# EAGLE design MAX9709_Mono_Bridge_AMP_1V2 (EAGLE 6.4)
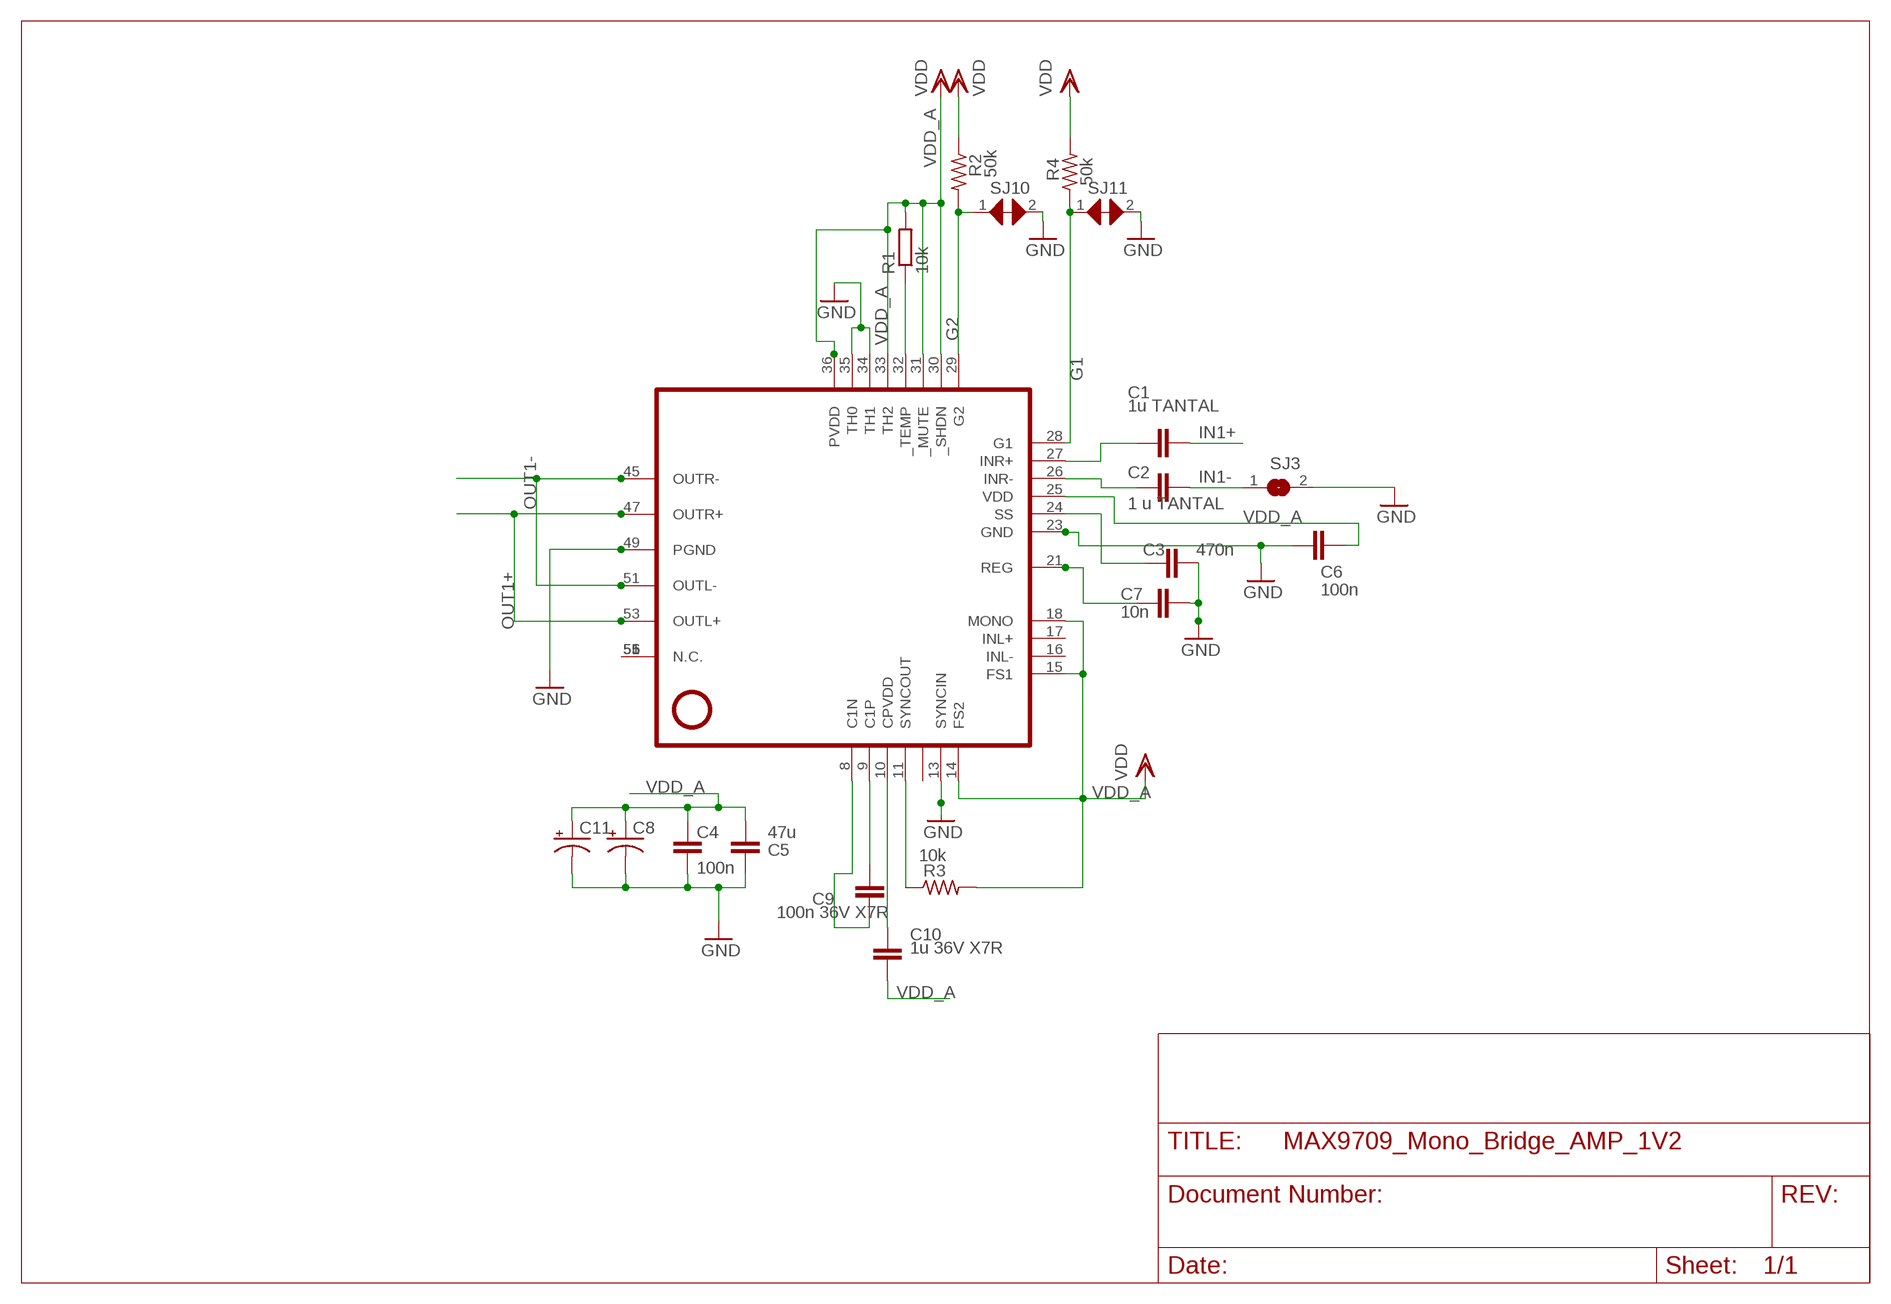
[diagram p0: schematic, sheet 1]

## Parts
C1  1u TANTAL  CAP-SMD0805  [0805]
C2  1 u TANTAL  CAP-SMD0805  [0805]
C3  470n  C-EUC0402K  [C0402K]
C4  100n  CAP-SMD0603  [0603]
C5  47u  CAP-SMD0603  [0603]
C6  100n  C-EUC0402K  [C0402K]
C7  10n  C-EUC0402K  [C0402K]
C8  CPOL-USCT7343  [CT7343]
C9  100n 36V X7R  CAP-SMD0805  [0805]
C10  1u 36V X7R  CAP-SMD0805  [0805]
C11  CPOL-USCT7343  [CT7343]
IC1  MAX9709  [56-QFN]
R1  10k  R-EU_R0402  [R0402]
R2  50k  R-US_R0402  [R0402]
R3  10k  R-US_R0402  [R0402]
R4  50k  R-US_R0402  [R0402]
SJ3  JUMPER_SMD  [JUMPER_SMD_SJ]
SJ10  JUMPER_SMD_MICRO_SHORT  [JUMPER_SMD_MICRO_SHORT]
SJ11  JUMPER_SMD_MICRO_SHORT  [JUMPER_SMD_MICRO_SHORT]

## Nets
G1: IC1.28(G1) R4.1 SJ11.1
G2: IC1.29(G2) R2.2 SJ10.1
GND: C3.2 C4.2 C5.2 C6.1 C7.2 C8.- C11.- IC1.2(PGND$2) IC1.3(PGND$3) IC1.4(PGND$4) IC1.13(SYNCIN) IC1.22(GND2) IC1.23(GND) IC1.34(TH1) IC1.35(TH0) IC1.39(PGND$39) IC1.40(PGND$40) IC1.41(PGND$41) IC1.49(PGND) IC1.50(PGND$8) IC1.P$1(GND1) IC1.P$2(GND3) IC1.P$3(GND4) IC1.P$4(GND5) IC1.P$5(GND6) IC1.P$6(GND7) IC1.P$7(GND8) IC1.P$8(GND9) IC1.P$9(GND10) IC1.P$10(GND11) IC1.P$11(GND12) IC1.P$12(GND13) IC1.P$13(GND14) IC1.P$14(GND15) IC1.P$15(GND16) IC1.P$16(GND17) IC1.P$17(GND18) IC1.P$18(GND19) IC1.P$19(GND20) IC1.P$20(GND21) IC1.P$21(GND22) IC1.P$22(GND23) IC1.P$23(GND24) IC1.P$24(GND25) IC1.P$25(GND26) SJ3.2 SJ10.2 SJ11.2
IN1+: C1.P$1
IN1-: C2.P$1 SJ3.1
N$1: C9.P$1 IC1.8(C1N)
N$2: C9.P$2 IC1.9(C1P)
N$4: C1.P$2 IC1.27(INR+)
N$5: C2.P$2 IC1.26(INR-)
N$8: IC1.32(_TEMP) R1.1
N$12: C10.P$2 IC1.10(CPVDD)
N$15: IC1.11(SYNCOUT) R3.1
OUT1+: IC1.47(OUTR+) IC1.48(OUTR+2) IC1.53(OUTL+) IC1.54(OUTL+2)
OUT1-: IC1.45(OUTR-) IC1.46(OUTR-2) IC1.51(OUTL-) IC1.52(OUTL-2)
REG: C7.1 IC1.19(REG3) IC1.20(REG2) IC1.21(REG)
SS: C3.1 IC1.24(SS)
VDD_A: C4.1 C5.1 C6.2 C8.+ C10.P$1 C11.+ IC1.5(PVDD$5) IC1.6(PVDD$6) IC1.7(PVDD$7) IC1.14(FS2) IC1.15(FS1) IC1.18(MONO) IC1.25(VDD) IC1.30(_SHDN) IC1.31(_MUTE) IC1.33(TH2) IC1.36(PVDD) IC1.37(PVDD$37) IC1.38(PVDD$38) R1.2 R2.1 R3.2 R4.2 ; supply symbol labelled VDD
Unconnected: IC1.1(N.C.) IC1.12(N.C.$12) IC1.16(INL-) IC1.17(INL+) IC1.42(N.C.$42) IC1.43(N.C.$43) IC1.44(N.C.$44) IC1.55(N.C.$55) IC1.56(N.C.$56)

## Library data of the parts
C1 C2 C4 C5 C9 C10 = lve:CAP-SMD
C3 C6 C7 = rcl:C-EU: CAPACITOR, European symbol
C8 C11 = rcl:CPOL-US: POLARIZED CAPACITOR, American symbol
IC1 = maxim_9709:MAX9709: Class D PA
R1 = rcl:R-EU_: RESISTOR, European symbol
R2-R4 = rcl:R-US_: RESISTOR, American symbol
SJ3 = lve:JUMPER_SMD
SJ10 SJ11 = dzo:JUMPER_SMD_MICRO_SHORT

## Board
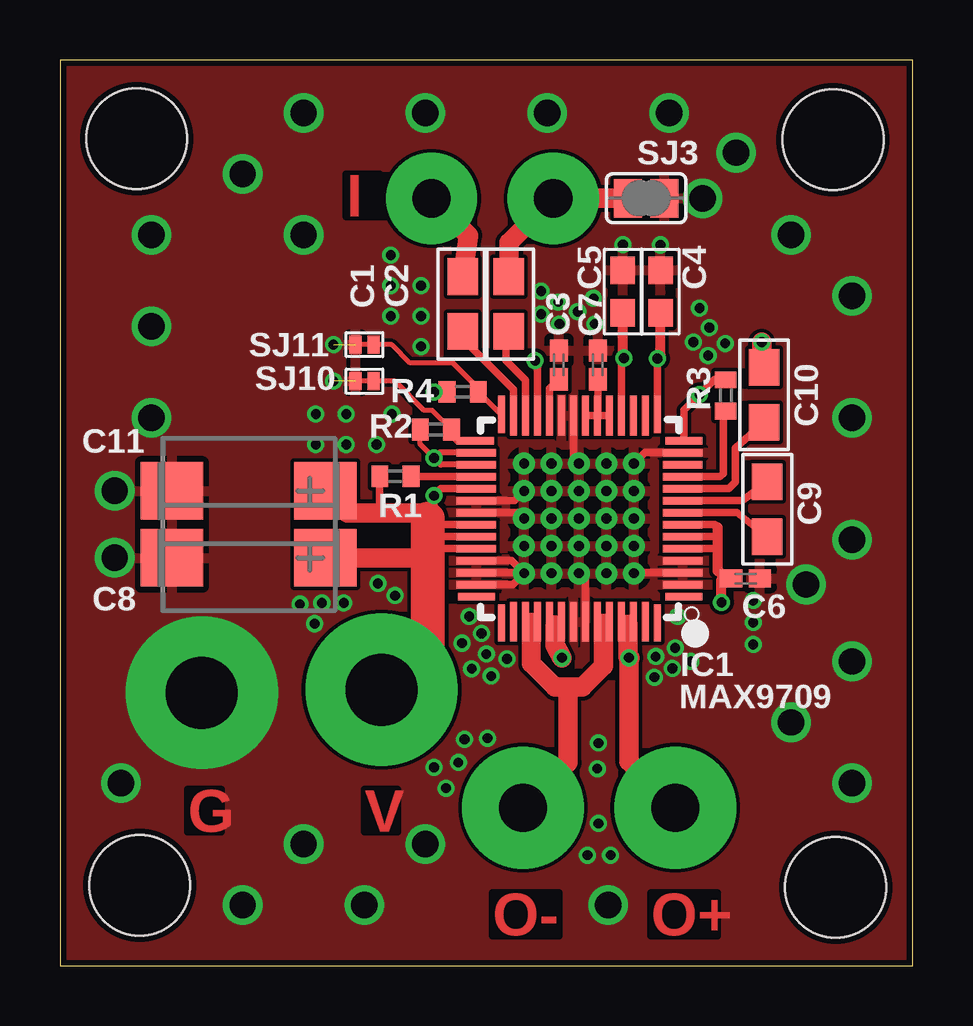
[diagram p1: board, top side]
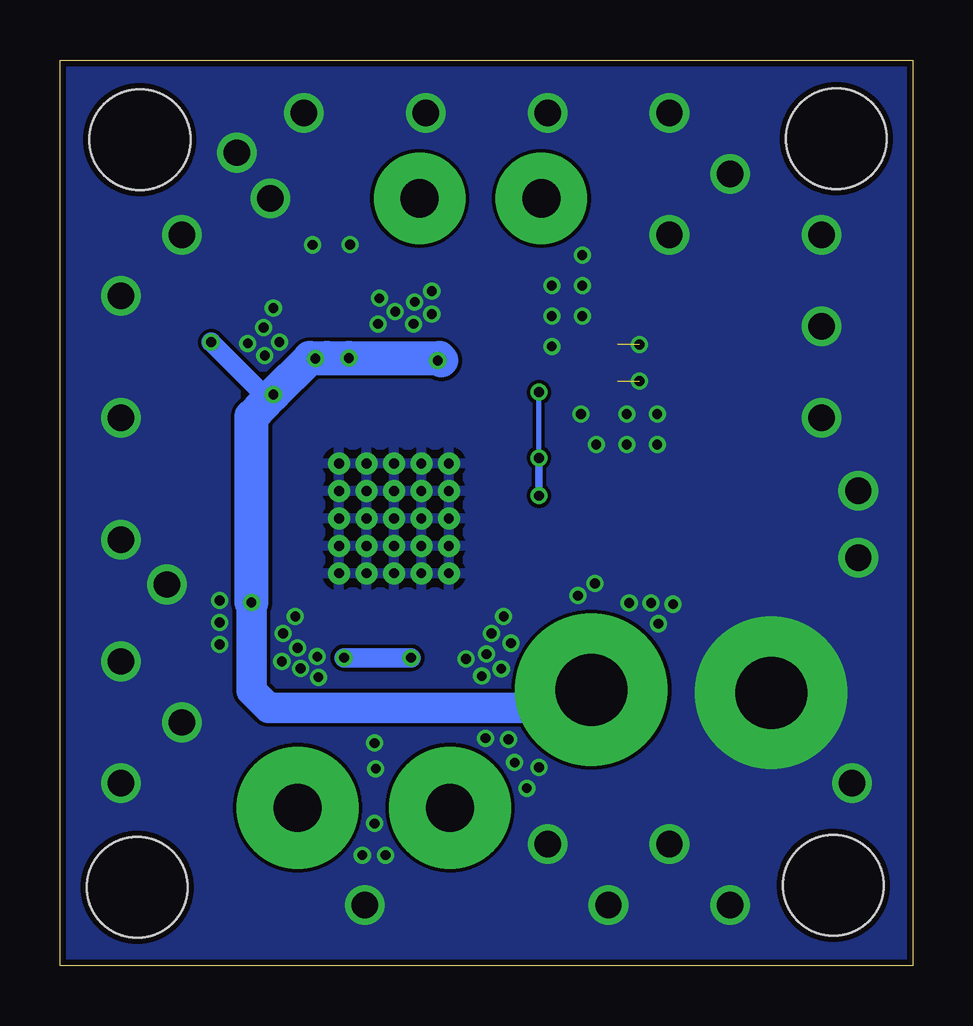
[diagram p2: board, bottom side, seen from below]

Size 35.56 x 37.77 mm. Coordinates in mm from the lower left corner, seen from the top.
Outline: 0,0 35.56,0 35.56,37.77 0,37.77 0,0
Copper layers (1*16): Top 0.035mm / dielectric 1.5mm / Bottom 0.035mm
Design rules "ITEADstudio_DRC": minimum track width 6mil, minimum drill 12mil, track to track 6mil, track to pad 6mil, pad to pad 6mil, via to via 6mil, smd to smd 0mil, copper to edge 10mil, drill to drill 10mil, minimum pad ring 10mil, minimum via ring 6mil, stop-mask expansion 2mil, vias tented up to drill 100mil, thermal gap 10mil
Holes 4.2 mm at 3.19,34.49 3.32,3.36 32.23,34.44 32.34,3.28

### Footprints (pad centres in the part's own frame; a part is rotated, then mirrored left to right if it is on the bottom)
0805 = smd 1.524 x 1.27: P$1 -1.143,0; P$2 1.143,0
C0402K = smd 0.925 x 0.74: 1 -0.6,0; 2 0.6,0
0603 = smd 1.143 x 1.016: 1 -0.889,0; 2 0.889,0
CT7343 = smd 2.6 x 2.4: + -3.2,0; - 3.2,0
56-QFN = smd 0.3 x 1.548: 1 -2.75,-3.081; 14 3.75,-3.081; 29 3.75,5.621; 42 -2.75,5.57 | smd 0.3 x 1.65: 2 -2.25,-3.03; 3 -1.75,-3.03; 4 -1.25,-3.03; 5 -0.75,-3.03; 6 -0.25,-3.03; 7 0.25,-3.03; 8 0.75,-3.03; 9 1.25,-3.03; 10 1.75,-3.03; 11 2.25,-3.03; 12 2.75,-3.03; 13 3.25,-3.03; 30 3.25,5.57; 31 2.75,5.57; 32 2.25,5.57; 33 1.75,5.57; 34 1.25,5.57; 35 0.75,5.57; 36 0.25,5.57; 37 -0.25,5.57; 38 -0.75,5.57; 39 -1.25,5.57; 40 -1.75,5.57; 41 -2.25,5.57 | smd 1.548 x 0.3: 15 4.851,-1.98; 28 4.851,4.52; 43 -3.851,4.52; 56 -3.851,-1.98 | smd 1.65 x 0.3: 16 4.8,-1.48; 17 4.8,-0.98; 18 4.8,-0.48; 19 4.8,0.02; 20 4.8,0.52; 21 4.8,1.02; 22 4.8,1.52; 23 4.8,2.02; 24 4.8,2.52; 25 4.8,3.02; 26 4.8,3.52; 27 4.8,4.02; 44 -3.8,4.02; 45 -3.8,3.52; 46 -3.8,3.02; 47 -3.8,2.52; 48 -3.8,2.02; 49 -3.8,1.52; 50 -3.8,1.02; 51 -3.8,0.52; 52 -3.8,0.02; 53 -3.8,-0.48; 54 -3.8,-0.98; 55 -3.8,-1.48 | drill 0.406: P$1 -1.778,3.581; P$2 0.508,3.581; P$3 -0.635,3.581; P$4 -0.635,2.438; P$5 1.651,3.581; P$6 2.794,3.581; P$7 2.794,2.438; P$8 1.651,2.438; P$9 0.508,2.438; P$10 -1.778,2.438; P$11 -1.778,1.295; P$12 -0.635,1.295; P$13 0.508,1.295; P$14 1.651,1.295; P$15 2.794,1.295; P$16 2.794,0.152; P$17 1.651,0.152; P$18 0.508,0.152; P$19 -0.635,0.152; P$20 -1.778,0.152; P$21 -1.778,-0.991; P$22 -0.635,-0.991; P$23 0.508,-0.991; P$24 1.651,-0.991; P$25 2.794,-0.991
R0402 = smd 0.7 x 0.9: 1 -0.65,0; 2 0.65,0
JUMPER_SMD_SJ = smd 1.168 x 1.6: 1 -0.762,0; 2 0.762,0
JUMPER_SMD_MICRO_SHORT = smd 0.508 x 0.762: 1 -0.381,0; 2 0.381,0

### Placement (x,y rotation side)
C1  16.78,27.6 270 top
C2  18.71,27.6 270 top
C3  20.8,25.06 90 top
C4  25.04,28.11 90 top
C5  23.46,28.11 90 top
C6  28.58,16.15 180 top
C7  22.42,25.06 90 top
C8  7.87,17.01 180 top
C9  29.48,19.04 90 top
C10  29.36,23.81 270 top
C11  7.87,19.81 180 top
IC1  22.93,18.15 90 top
R1  13.98,20.42 180 top
R2  15.67,22.36 0 top
R3  27.76,23.79 90 top
R4  16.78,23.94 180 top
SJ3  24.44,32.01 0 top
SJ10  12.69,24.38 180 top
SJ11  12.69,25.9 180 top

### Tracks (layer width: path | path; a pad name or v marks a point on that pad's centre or on a via)
G1
  Top 0.203: IC1.28 18.37,23 R4.1 17.43,24.09 16.38,25.14 14.6,25.14 13.84,25.9 SJ11.1
G2
  Top 0.203: R2.2 15.52,23.16 15.18,23.16 13.96,24.38 SJ10.1
  Top 0.305: IC1.29 16.58,21.9 16.16,22.31 R2.2
GND  (via drill 0.41, 1.1, 3 pad 6.35)  (2 unrouted)
  Top 0.305: IC1.22 21.41,21.17 IC1.P$15 | IC1.13 24.38,21.4 IC1.P$25 | IC1.3 23.95,16.4 IC1.P$21 | IC1.50 21.91,16.1 IC1.P$11 | IC1.41 18.88,15.9 IC1.P$1 | IC1.40 19.32,16.4 IC1.P$1 | IC1.39 18.82,16.9 IC1.P$1 | IC1.34 18.95,19.4 IC1.P$5 | IC1.35 19.11,18.9 IC1.P$2
  other vias: 5.91,11.39 10.15,5.08 15.23,5.08 33.01,7.62 33.01,12.7 30.47,10.16 31.11,15.9 33.01,17.78 33.01,22.86 33.01,27.94 25.39,35.56 10.15,35.56 7.61,33.02 28.19,33.91 30.47,30.48 2.28,17.01 2.28,19.81 25.03,30.06 23.46,30.07 26.79,32 25.75,14.58 26.26,13.86 25.65,13.26 18.64,12.8 17.77,13 17.57,13.86 17.06,14.58 17.98,12.09 16.76,13.46 17.16,12.39 13.96,15.44 13.25,15.95 10.66,21.74 15.06,25.83 20.82,26.77 22.3,26.77 21.58,27.28 20.06,27.17 22.24,27.83 20.77,27.68 20.06,28.14 27.02,25.45 26.41,26.01 27.73,25.96 27.07,26.62 26.66,27.43 28.9,15.24 28.9,14.32 28.9,13.41 22.45,9.29 22.4,8.23 22.45,5.94 21.99,4.62 22.96,4.62 17.83,9.5 16.86,9.45 16.61,8.48 15.59,8.28 16.1,7.41 11.83,15.13 10.92,15.13 10.61,14.27 10,15.08 15.23,35.56 20.31,35.56 24.84,12.9 24.78,12.04 26.31,12.7 25.53,12.41 11.4,25.9 11.4,24.38 15.06,27.1 15.06,28.37 13.79,27.1 13.79,28.37 13.79,29.64 11.93,21.74 13.2,21.74 13.84,23.01 11.93,23.01 10.66,23.01 10.15,30.48 3.8,30.48 3.8,26.67 3.8,22.86 2.53,7.62 7.61,2.54 12.69,2.54 22.85,2.54
  pour Top: 0.02,0.06 0.02,37.76 35.65,37.76 35.65,0.06
  pour Bottom: 0.02,37.76 0.02,0.06 35.68,0.06 35.68,37.76
IN1+  (via drill 1.6 pad 3.81)
  Top 0.813: C1.P$1 17.04,30.45 v15.49,32
IN1-  (via drill 1.6 pad 3.81)
  Top 0.813: C2.P$1 18.71,30.15 v20.57,32 SJ3.1
N$1
  Top 0.305: IC1.8 28.23,18.9 C9.P$1
N$2
  Top 0.305: IC1.9 28.45,19.4 C9.P$2
N$4
  Top 0.305: IC1.27 18.91,24.02 17.04,25.9 C1.P$2
N$5
  Top 0.305: C2.P$2 18.7,26.27 | IC1.26 19.41,24.42 18.59,25.24 18.59,26.33 C2.P$2 | C2.P$2 18.59,26.02
N$8
  Top 0.305: IC1.32 14.71,20.4 R1.1
N$12
  Top 0.305: IC1.10 27.88,19.9 28.16,20.18 28.16,21.6 C10.P$2
N$15
  Top 0.305: IC1.11 27.52,20.4 27.66,20.54 27.66,23.04 R3.1
OUT1+  (via drill 0.41, 2 pad 5.08)
  Top 0.305: IC1.53 IC1.54 23.8,14.24 23.67,14.24 | IC1.48 20.8,14.24 20.65,14.24 20.52,14.24 IC1.47
  Top 0.787: 20.65,13.42 20.65,14.24
  Top 0.813: 20.65,13.42 20.65,13.38 v20.92,12.85 | v23.72,12.85 23.75,12.85 23.72,12.81 | v23.72,12.85 23.72,8.53 v25.65,6.6 | 23.67,14.24 23.67,12.9 v23.72,12.85
  Bottom 0.813: v23.72,12.85 v20.92,12.85
OUT1-  (via drill 2 pad 5.08)
  Top 0.305: IC1.45 IC1.46 19.67,14.35 19.66,14.34 | IC1.51 22.47,14.29 22.66,14.29 22.85,14.29 IC1.52
  Top 0.787: 19.66,12.61 19.66,14.34
  Top 0.813: 22.66,14.29 22.66,12.5 21.79,11.63 21.18,11.63 | 19.66,12.61 20.64,11.63 21.18,11.63 | 21.18,11.63 21.18,8.48 v19.3,6.6
REG
  Top 0.305: IC1.20 IC1.21 IC1.20 | IC1.20 IC1.19 | C7.1 22.42,22.96 IC1.20
SS
  Top 0.305: IC1.24 20.41,24.07 C3.1
VDD_A  (via drill 0.41, 3 pad 6.35)
  Top 0.203: R2.1 15.02,21.75 v15.59,21.18 | R4.2 15.61,23.94 v15.59,23.92
  Top 0.254: IC1.30 15.81,21.4 v15.59,21.18 15.87,20.9 IC1.31
  Top 0.305: IC1.33 15.88,19.9 v15.59,19.61 15.59,18.28 | 15.59,17.9 15.59,18.28 | 15.59,17.9 15.65,17.97 15.72,17.9 IC1.37 | IC1.25 19.91,25.14 v19.81,25.24 | IC1.6 27.3,17.9 27.43,17.78 | 27.4,17.4 IC1.5 | IC1.7 27.31,18.4 27.41,18.3 | v24.91,25.32 IC1.15 | IC1.18 23.41,25.34 v23.51,25.35 | IC1.14 26.01,23.17 v26.66,23.82 27.28,24.44 R3.2 | 15.59,17.9 | 15.34,18.64 15.45,18.75 | IC1.38 15.36,17.4 15.34,17.37 | 15.59,17.9 15.46,17.9 15.34,17.78 | IC1.36 15.7,18.4 15.59,18.28 | R1.2 13.33,19.02 13.46,18.89
  Top 0.406: v27.58,15.16 27.58,16.13 C6.2 27.43,16.45 27.43,17.37 | 27.41,18.3 27.43,18.18 27.43,17.78 27.43,17.37 | 27.43,17.37 27.4,17.4 | C5.1 23.46,25.4 v23.51,25.35 | C4.1 25.04,25.45 v24.91,25.32
  Top 0.813: C10.P$1 29.26,24.98 v29.26,26.01 | C8.+ 15.08,17.01 15.34,16.76 | C11.+ 11.98,18.89 13.46,18.89 15.08,18.89 15.34,18.64
  Top 1.422: v13.41,11.52 15.34,13.45 15.34,16.76 15.34,17.37 15.34,17.78 15.34,18.64
  Bottom 0.203: v15.59,21.18 v15.59,23.92
  Bottom 0.305: v15.59,19.61 v15.59,21.18 | 19.65,25.24 v19.81,25.24 | v24.91,25.32 24.45,25.32 24.43,25.35
  Bottom 0.813: v29.26,26.01 27.02,23.77 27.02,23.47
  Bottom 1.27: v13.41,11.52 14.16,10.77 26.87,10.77 27.58,11.48 v27.58,15.16
  Bottom 1.422: v27.58,15.16 27.58,22.91 27.02,23.47 v26.66,23.82 25.14,25.35 24.43,25.35 v23.51,25.35 19.76,25.35 19.65,25.24

### Text on the board
Top: I | G | V | O- | O+